# EAGLE design Shield (EAGLE 9.6.0)
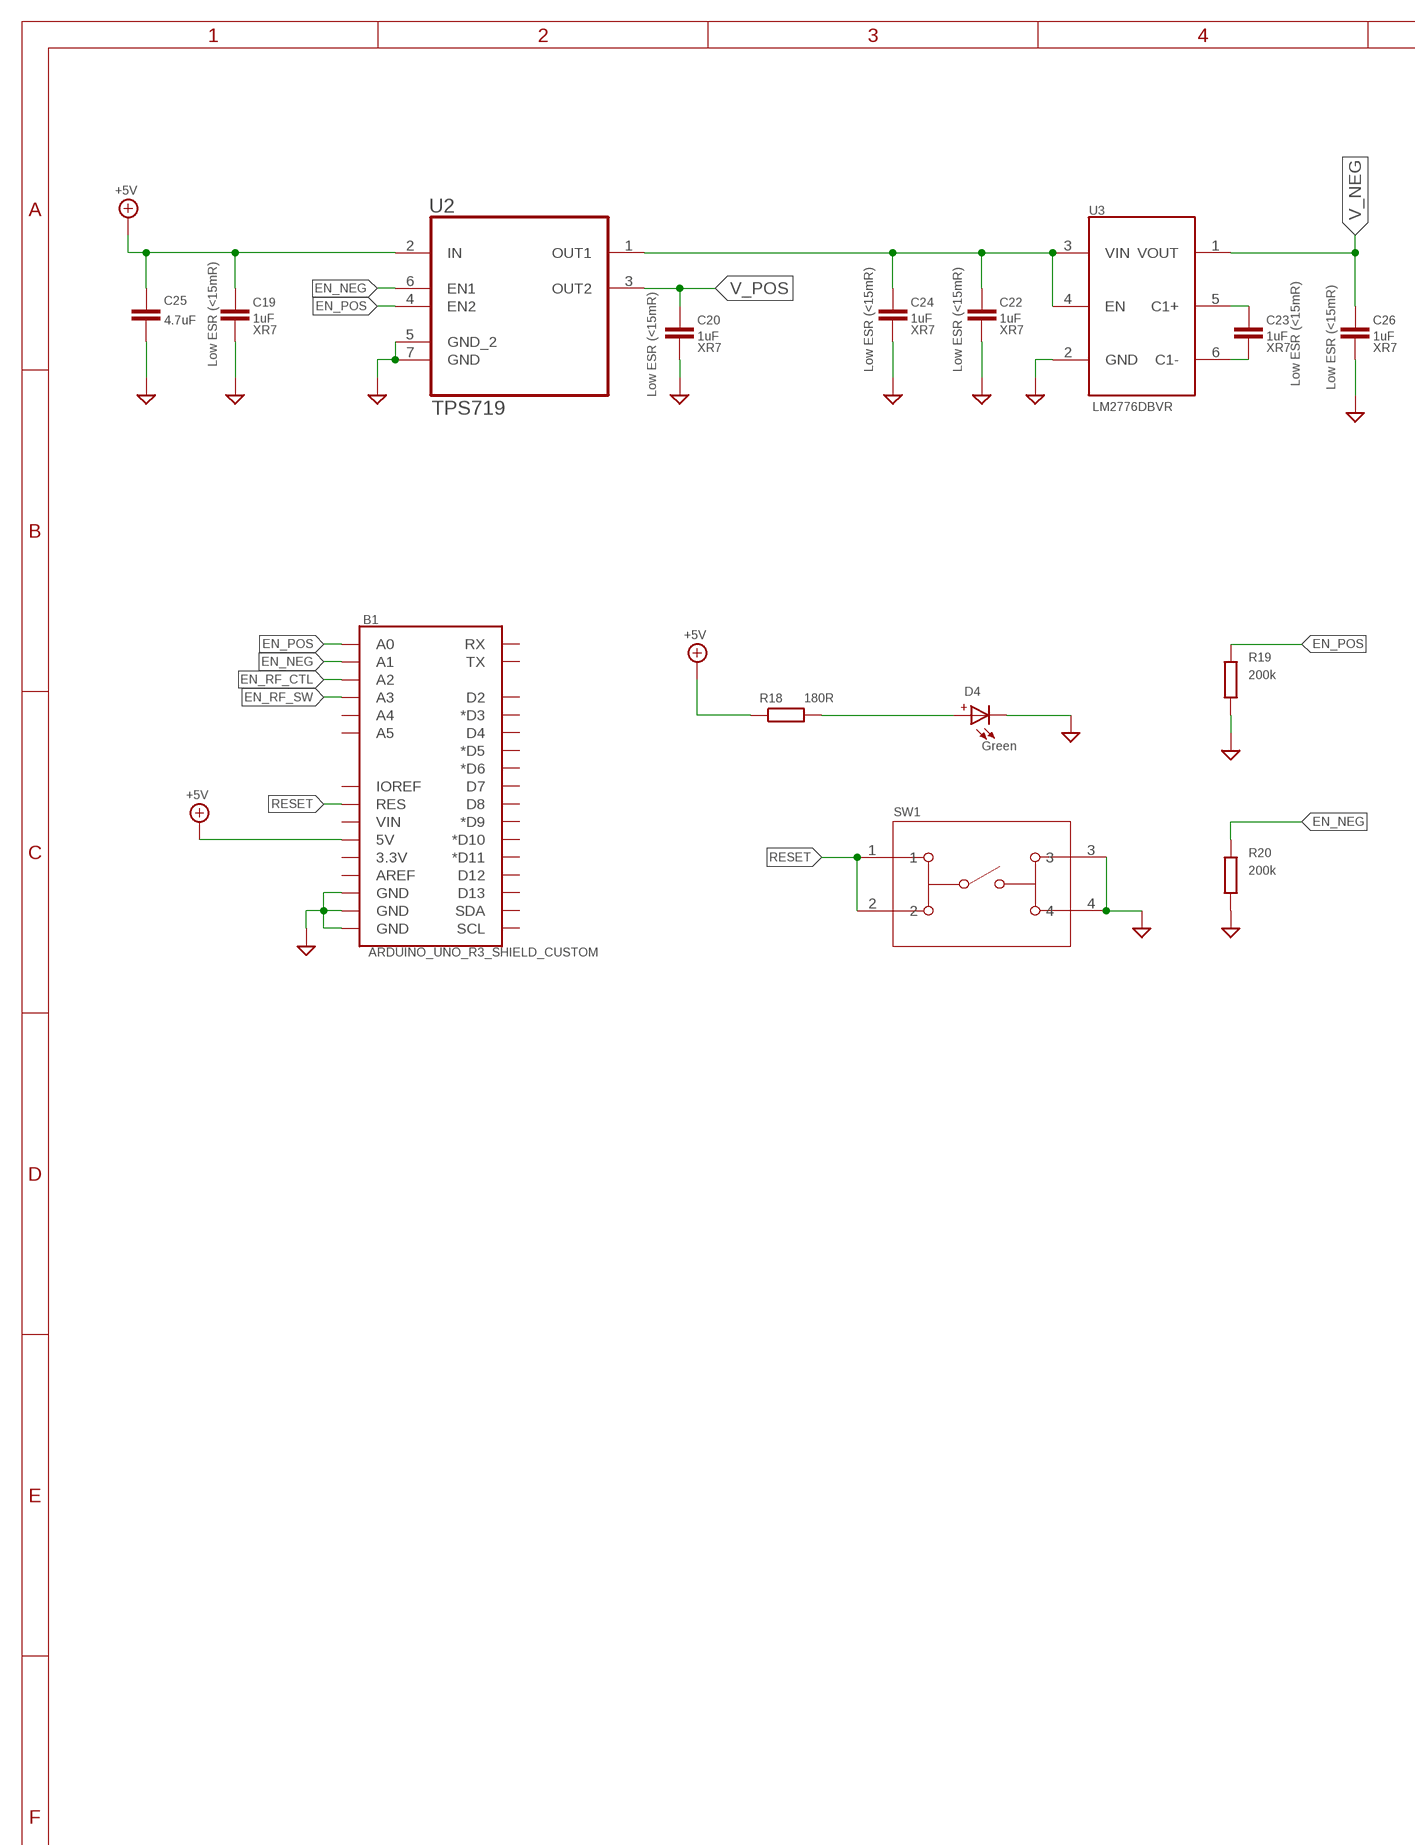
[diagram p0: schematic, sheet 1, part 1 of 2]
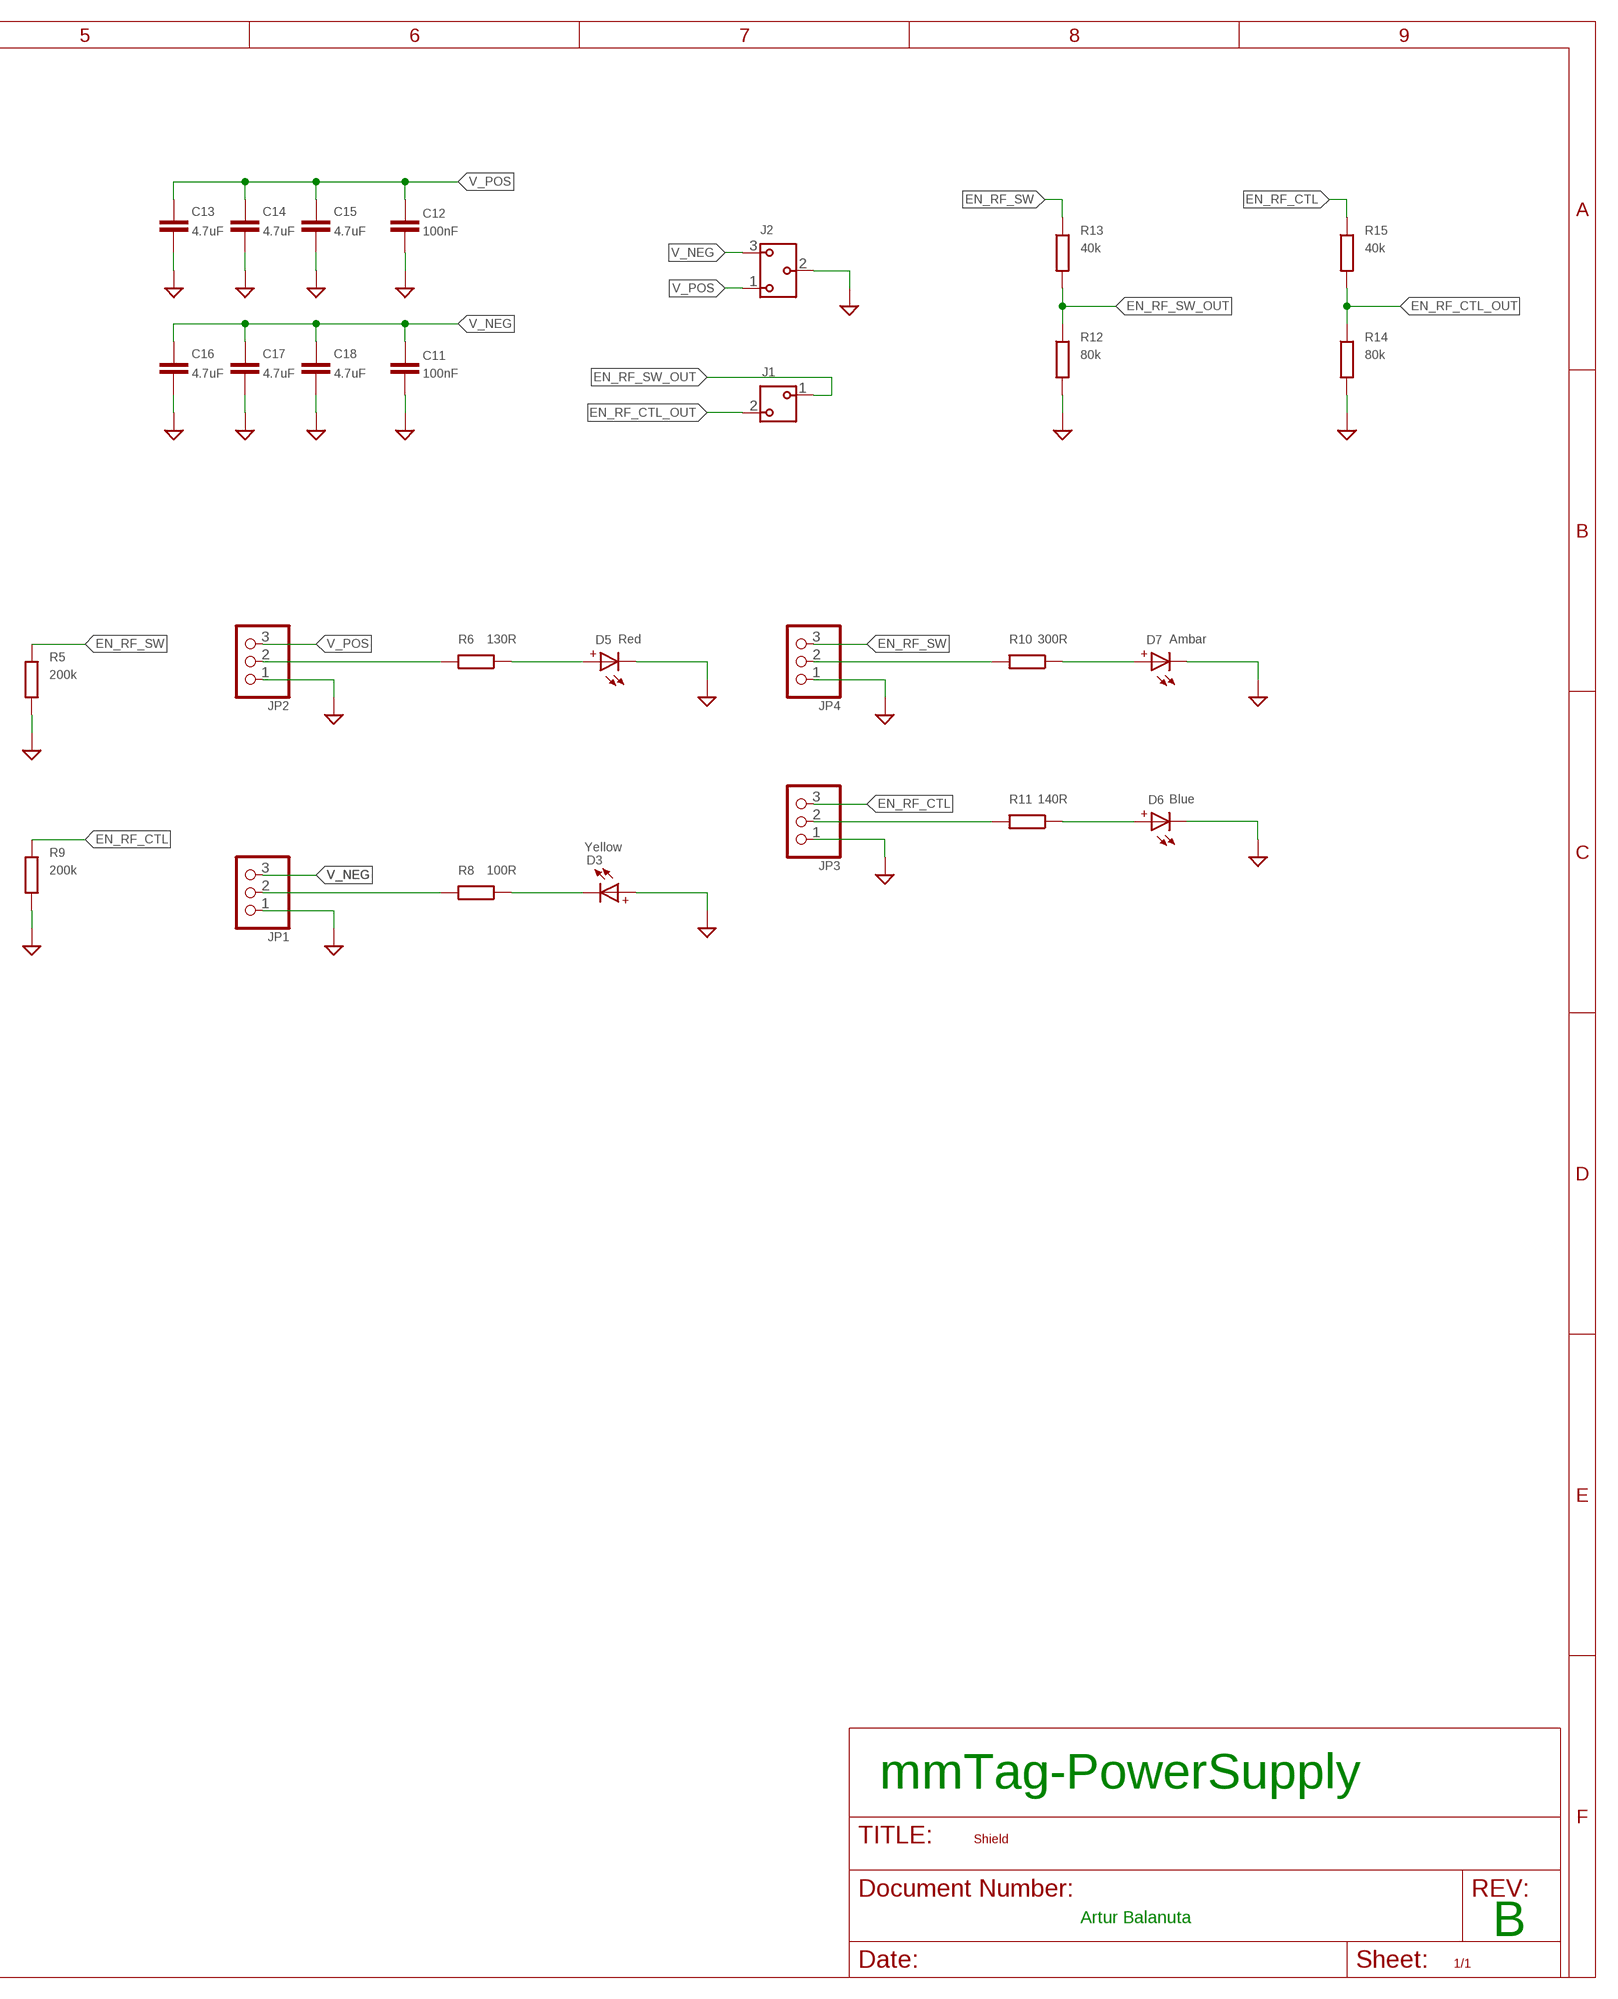
[diagram p1: schematic, sheet 1, part 2 of 2]

## Parts
B1  ARDUINO_UNO_R3_SHIELD_CUSTOM  [UNO_R3_SHIELD_NO_PROG]
C11  100nF  C-EUC0603  [C0603]
C12  100nF  C-EUC0603  [C0603]
C13  4.7uF  C-EUC1206  [C1206]
C14  4.7uF  C-EUC1206  [C1206]
C15  4.7uF  C-EUC1206  [C1206]
C16  4.7uF  C-EUC1206  [C1206]
C17  4.7uF  C-EUC1206  [C1206]
C18  4.7uF  C-EUC1206  [C1206]
C19  1uF  C-EUC0603  [C0603]
C20  1uF  C-EUC0603  [C0603]
C22  1uF  C-EUC0603  [C0603]
C23  1uF  C-EUC0603  [C0603]
C24  1uF  C-EUC0603  [C0603]
C25  4.7uF  C-EUC1206  [C1206]
C26  1uF  C-EUC0603  [C0603]
D3  WL-SMCW-150080YS75000  [WL-SMCW_0805]
D4  WL-SMCW-150080GS75000  [WL-SMCW_0805]
D5  WL-SMCW-150080RS75000  [WL-SMCW_0805]
D6  WL-SMCW-150080BS75000  [WL-SMCW_0805]
D7  WL-SMCW_150080AS75000  [WL-SMCW_0805]
J1  691412320002  [691412320002]
J2  691412320003  [691412320003]
JP1  PINHD-1X3  [1X03]
JP2  PINHD-1X3  [1X03]
JP3  PINHD-1X3  [1X03]
JP4  PINHD-1X3  [1X03]
R5  200k  R-EU_R0603  [R0603]
R6  130R  R-EU_R0603  [R0603]
R8  100R  R-EU_R0603  [R0603]
R9  200k  R-EU_R0603  [R0603]
R10  300R  R-EU_R0603  [R0603]
R11  140R  R-EU_R0603  [R0603]
R12  80k  R-EU_R0603  [R0603]
R13  40k  R-EU_R0603  [R0603]
R14  80k  R-EU_R0603  [R0603]
R15  40k  R-EU_R0603  [R0603]
R18  180R  R-EU_R0603  [R0603]
R19  200k  R-EU_R0603  [R0603]
R20  200k  R-EU_R0603  [R0603]
SW1  1825910-6  [SW4_1825910-B]
U2  TPS719  [SON6_5P200X200X80-7N]
U3  LM2776DBVR  [TEXAS_SOT23-6]

## Nets
+5V: B1.5V C19.1 C25.1 R18.1 U2.2(IN)
EN_NEG: B1.A1 R20.1 U2.6(EN1)
EN_POS: B1.A0 R19.1 U2.4(EN2)
EN_RF_CTL: B1.A2 JP3.3 R9.1 R15.1
EN_RF_CTL_OUT: J1.2 R14.1 R15.2
EN_RF_SW: B1.A3 JP4.3 R5.1 R13.1
EN_RF_SW_OUT: J1.1 R12.1 R13.2
GND: B1.GND@0(GND) B1.GND@1(GND) B1.GND@2(GND) C11.2 C12.2 C13.2 C14.2 C15.2 C16.2 C17.2 C18.2 C19.2 C20.2 C22.2 C24.2 C25.2 C26.2 D3.2(+) D4.1(-) D5.1(-) D6.1(-) D7.1(-) J2.2 JP1.1 JP2.1 JP3.1 JP4.1 R5.2 R9.2 R12.2 R14.2 R19.2 R20.2 SW1.3 SW1.4 U2.5(GND_2) U2.7(GND) U3.2(GND)
N$2: D4.2(+) R18.2
N$4: C22.1 C24.1 U2.1(OUT1) U3.3(VIN) U3.4(EN)
N$11: C23.1 U3.5(C1+)
N$12: C23.2 U3.6(C1-)
N$17: D5.2(+) R6.1
N$18: D3.1(-) R8.1
N$19: JP2.2 R6.2
N$20: JP1.2 R8.2
N$21: D7.2(+) R10.1
N$22: D6.2(+) R11.1
N$23: JP4.2 R10.2
N$24: JP3.2 R11.2
RESET: B1.RES SW1.1 SW1.2
V_NEG: C11.1 C16.1 C17.1 C18.1 C26.1 J2.3 JP1.3 U3.1(VOUT)
V_POS: C12.1 C13.1 C14.1 C15.1 C20.1 J2.1 JP2.3 U2.3(OUT2)
Unconnected: B1.3.3V B1.A4 B1.A5 B1.AREF B1.D2 B1.D3(*D3) B1.D4 B1.D5(*D5) B1.D6(*D6) B1.D7 B1.D8 B1.D9(*D9) B1.D10(*D10) B1.D11(*D11) B1.D12 B1.D13 B1.IOREF B1.RX B1.SCL B1.SDA B1.TX B1.VIN

## Notes on the sheet
- mmTag-PowerSupply
- Artur Balanuta
- B

## Library data of the parts
B1 = mmTag_PowerSupply:ARDUINO_UNO_R3_SHIELD_CUSTOM: Arduino R3 Shield Footprint Shield form compatible with the Arduino Uno R3. SparkFun Products: MG2639 Cellular Shield <https://www.sparkfun.com/products/13120> MIDI Shield <https://www.sparkfun.com/products/12898> R3 Stackable Headers Kit <https://www.sparkfun.com/products/11417>
C11-C18 C25 = resistor:C-EU: CAPACITOR, European symbol
C19 C20 C22-C24 C26 = resistor:C-EU: CAPACITOR, European symbol; ESR: Low ESR (<15mR); TYPE: XR7
D3 = Wurth_Elektronik_Optoelectronics_rev19b:WL-SMCW: SMD mono-color Chip LED Characteristics Low energy consumption High reliability Low current requirement Fast switching No UV/IR radiation Smallest SMD package with exceptional brightness Top view Wide viewing angle PBC high-usage Applications Backlight for mobile and portable device keypads Indoor and outdoor message boards Flat backlight for LCDs, switches and symbols Display for industrial control systems and traffic Miniaturized color effects Pedestrian mark Optical indicators General lighting Toys <http://katalog.we-online.de/media/images/v2/Family_WL-SMCW.jpg> Details see: http://katalog.we-online.de/en/led/WL-SMCW?m Updated 2015-04-10 2015 (C) Wurth Elektronik; COLOR: Yellow
D4 = Wurth_Elektronik_Optoelectronics_rev19b:WL-SMCW: SMD mono-color Chip LED Characteristics Low energy consumption High reliability Low current requirement Fast switching No UV/IR radiation Smallest SMD package with exceptional brightness Top view Wide viewing angle PBC high-usage Applications Backlight for mobile and portable device keypads Indoor and outdoor message boards Flat backlight for LCDs, switches and symbols Display for industrial control systems and traffic Miniaturized color effects Pedestrian mark Optical indicators General lighting Toys <http://katalog.we-online.de/media/images/v2/Family_WL-SMCW.jpg> Details see: http://katalog.we-online.de/en/led/WL-SMCW?m Updated 2015-04-10 2015 (C) Wurth Elektronik; COLOR: Green
D5 = Wurth_Elektronik_Optoelectronics_rev19b:WL-SMCW: SMD mono-color Chip LED Characteristics Low energy consumption High reliability Low current requirement Fast switching No UV/IR radiation Smallest SMD package with exceptional brightness Top view Wide viewing angle PBC high-usage Applications Backlight for mobile and portable device keypads Indoor and outdoor message boards Flat backlight for LCDs, switches and symbols Display for industrial control systems and traffic Miniaturized color effects Pedestrian mark Optical indicators General lighting Toys <http://katalog.we-online.de/media/images/v2/Family_WL-SMCW.jpg> Details see: http://katalog.we-online.de/en/led/WL-SMCW?m Updated 2015-04-10 2015 (C) Wurth Elektronik; COLOR: Red
D6 = Wurth_Elektronik_Optoelectronics_rev19b:WL-SMCW: SMD mono-color Chip LED Characteristics Low energy consumption High reliability Low current requirement Fast switching No UV/IR radiation Smallest SMD package with exceptional brightness Top view Wide viewing angle PBC high-usage Applications Backlight for mobile and portable device keypads Indoor and outdoor message boards Flat backlight for LCDs, switches and symbols Display for industrial control systems and traffic Miniaturized color effects Pedestrian mark Optical indicators General lighting Toys <http://katalog.we-online.de/media/images/v2/Family_WL-SMCW.jpg> Details see: http://katalog.we-online.de/en/led/WL-SMCW?m Updated 2015-04-10 2015 (C) Wurth Elektronik; COLOR: Blue
D7 = Wurth_Elektronik_Optoelectronics_rev19b:WL-SMCW: SMD mono-color Chip LED Characteristics Low energy consumption High reliability Low current requirement Fast switching No UV/IR radiation Smallest SMD package with exceptional brightness Top view Wide viewing angle PBC high-usage Applications Backlight for mobile and portable device keypads Indoor and outdoor message boards Flat backlight for LCDs, switches and symbols Display for industrial control systems and traffic Miniaturized color effects Pedestrian mark Optical indicators General lighting Toys <http://katalog.we-online.de/media/images/v2/Family_WL-SMCW.jpg> Details see: http://katalog.we-online.de/en/led/WL-SMCW?m Updated 2015-04-10 2015 (C) Wurth Elektronik; COLOR: Ambar
J1 = Wurth_Connectors_WR-TBL Spring Clamp:691412320002: WR-TBL Serie 4123 - 3.81 mm Screwless 45° Entry KIND PROPERTIES Pitch 3.81 mm MATERIAL PROPERTIES Insulator Material PA6/66 Insulator Flammability Rating UL94 V-0 Insulator Color Grey Contact Material Phosphor Bronze Contact Plating Matte Tin Wire Guard Material Phosphor Bronze GENERAL INFORMATION Operating Temperature -30 up to +120 °C Compliance Lead free / RoHS ELECTRICAL PROPERTIES IR UL 4 A IR VDE 4 A Working Voltage [UL] 300 V (AC) Working Voltage [VDE] 450 V (AC) Withstanding Voltage [UL] 1600 V (AC) Withstanding Voltage [VDE] 2500 V (AC) Contact Resistance 20 mΩ Mechanical Properties Wire Strip Length 7 (mm) Wire Properties Solid Wire Section (AWG) 16 to 30 (AWG) Solid Wire Section (Metric) 1.31 to 0.0509 (mm²) Stranded Wire Section (AWG) 16 to 30 (AWG) Stranded Wire Section (Metric) 1.31 to 0.0509 (mm²) CERTIFICATION UL Approval E150931 VDE Approval 40013441 Packaging Properties Packaging Box <https://www.we-online.com/catalog/media/o84303v209%20Family_WR-TBL4_6914123200xx.jpg> Details see: https://www.we-online.com/catalog/en/TBL_3_81_4123_SCREWLESS_45-DEGREE_ENTRY_6914123200xx/ Updated by Ella Wu 2019-12-31 2019(C) Wurth Elektronik; DATASHEET-URL: https://www.we-online.com/catalog/datasheet/691412320002.pdf; IR-UL: 4A; IR-VDE: 4A; MOUNT: THT; PART-NUMBER: 691412320002; PINS: 2; PITCH: 3.81mm; TYPE: 45°; WIRE: 16 to 30 (AWG) 1.31 to 0.05 (mm²); WORKING-VOLTAGE-UL: 300V (AC); WORKING-VOLTAGE-VDE: 450V (AC)
J2 = Wurth_Connectors_WR-TBL Spring Clamp:691412320003: WR-TBL Serie 4123 - 3.81 mm Screwless 45° Entry KIND PROPERTIES Pitch 3.81 mm MATERIAL PROPERTIES Insulator Material PA6/66 Insulator Flammability Rating UL94 V-0 Insulator Color Grey Contact Material Phosphor Bronze Contact Plating Matte Tin Wire Guard Material Phosphor Bronze GENERAL INFORMATION Operating Temperature -30 up to +120 °C Compliance Lead free / RoHS ELECTRICAL PROPERTIES IR UL 4 A IR VDE 4 A Working Voltage [UL] 300 V (AC) Working Voltage [VDE] 450 V (AC) Withstanding Voltage [UL] 1600 V (AC) Withstanding Voltage [VDE] 2500 V (AC) Contact Resistance 20 mΩ Mechanical Properties Wire Strip Length 7 (mm) Wire Properties Solid Wire Section (AWG) 16 to 30 (AWG) Solid Wire Section (Metric) 1.31 to 0.0509 (mm²) Stranded Wire Section (AWG) 16 to 30 (AWG) Stranded Wire Section (Metric) 1.31 to 0.0509 (mm²) CERTIFICATION UL Approval E150931 VDE Approval 40013441 Packaging Properties Packaging Box <https://www.we-online.com/catalog/media/o84303v209%20Family_WR-TBL4_6914123200xx.jpg> Details see: https://www.we-online.com/catalog/en/TBL_3_81_4123_SCREWLESS_45-DEGREE_ENTRY_6914123200xx/ Updated by Ella Wu 2019-12-31 2019(C) Wurth Elektronik; DATASHEET-URL: https://www.we-online.com/catalog/datasheet/691412320003.pdf; IR-UL: 4A; IR-VDE: 4A; MOUNT: THT; PART-NUMBER: 691412320003; PINS: 3; PITCH: 3.81mm; TYPE: 45°; WIRE: 16 to 30 (AWG) 1.31 to 0.05 (mm²); WORKING-VOLTAGE-UL: 300V (AC); WORKING-VOLTAGE-VDE: 450V (AC)
JP1-JP4 = pinhead:PINHD-1X3: PIN HEADER
R5 R6 R8-R15 R18-R20 = resistor:R-EU_: RESISTOR, European symbol
SW1 = Switches:1825910-6; BUILT_BY: EMA_UL_Team; CATEGORY: Tactile Switches; CONFIGURATION__POLE-THROW_: Single Pole - Single Throw; COPYRIGHT: Copyright (C) 2016 Accelerated Designs. All rights reserved; DESCRIPTION: FSM4JH=6MM TACT SWITCH, HIGH TEMP; MANUFACTURER_PART_NUMBER: 1825910-6; MAX_SWITCHING_CURRENT: -; MAX_SWITCHING_VOLTAGE_AC_: -; PART_STATUS: active; PRODUCT_TYPE: Switch; SERIES: ?Alcoswitch FSM; SWITCH_TYPE: Tactile Switches; TE_PART_NUMBER: 1825910-6; VENDOR: TE Connectivity
U2 = mmTag_PowerSupply:TPS719: Low-Dropout Linear Regulators; DESCRIPTION: Dual 200mA Output, Low Noise, High PSRR, Low Dropout, Linear Regulator 6-WSON -40 to 125; MF: Texas Instruments; PACKAGE: SON-6 Texas Instruments
U3 = mmTag_PowerSupply:LM2776: Switched Capacitor Inverter

## Net classes
0 default: width 0.203 mm, drill 0.305 mm, clearance 0.152 mm
3 usbvcc: width 0.203 mm, drill 0.305 mm, clearance 0.203 mm

## Board
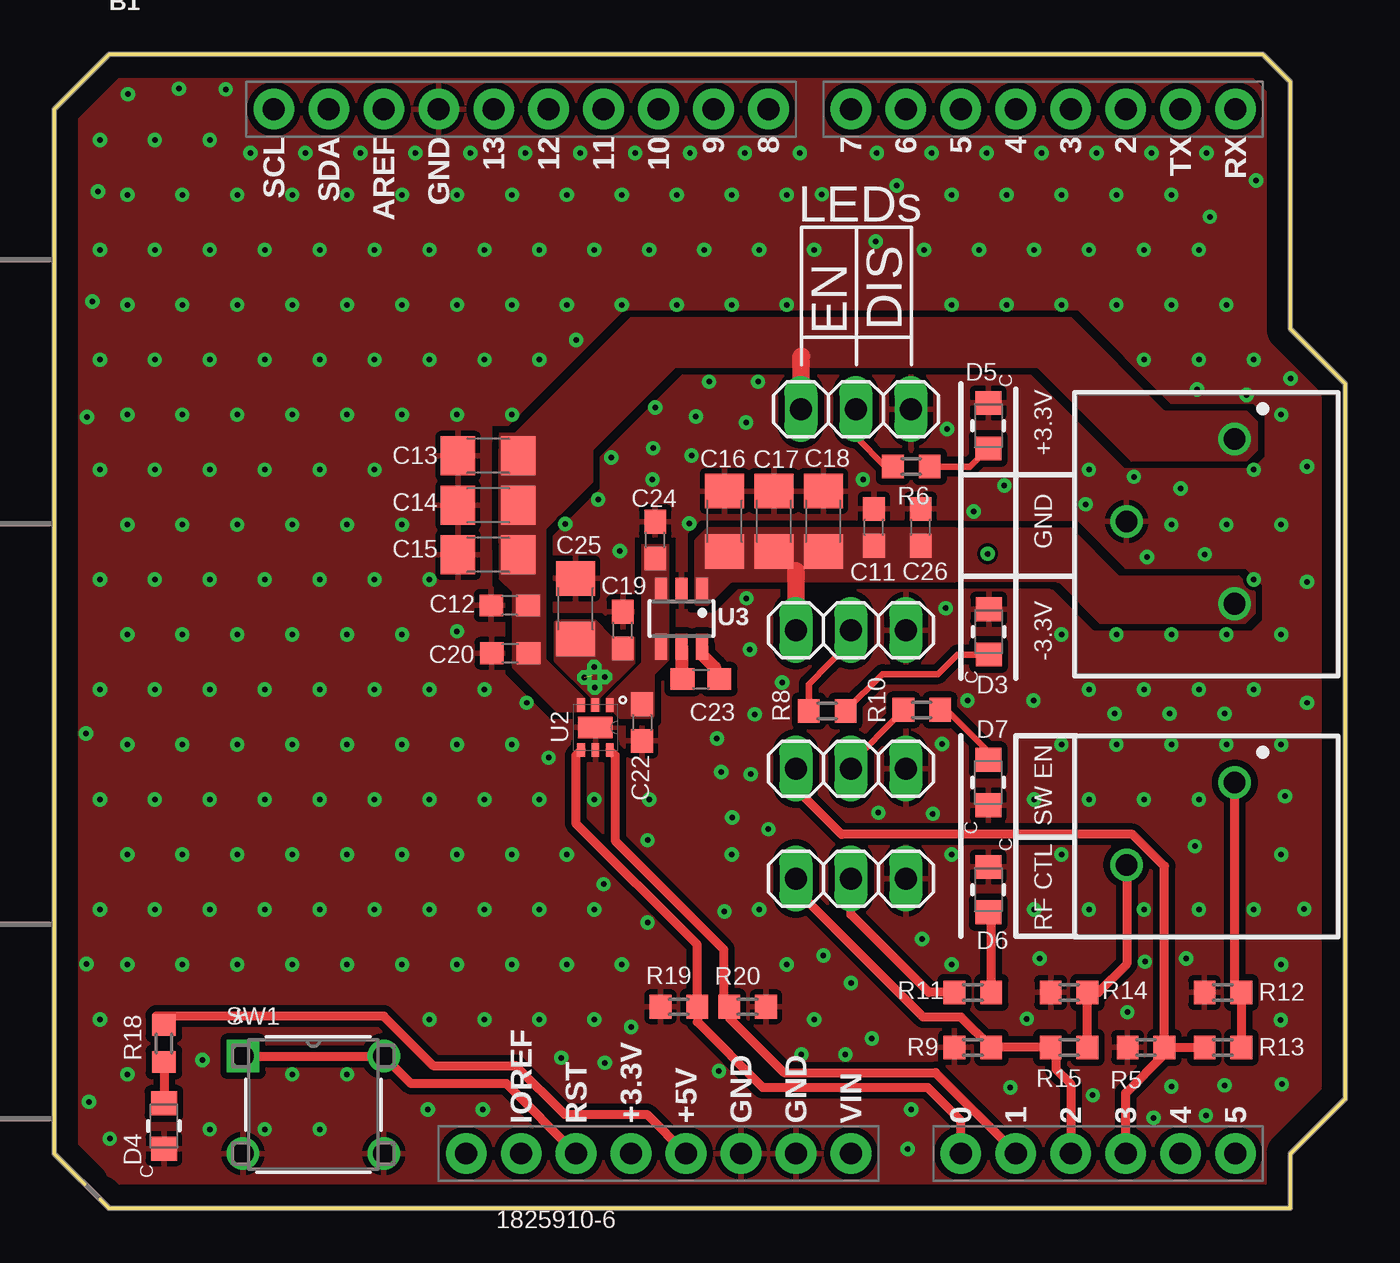
[diagram p2: board, top side]
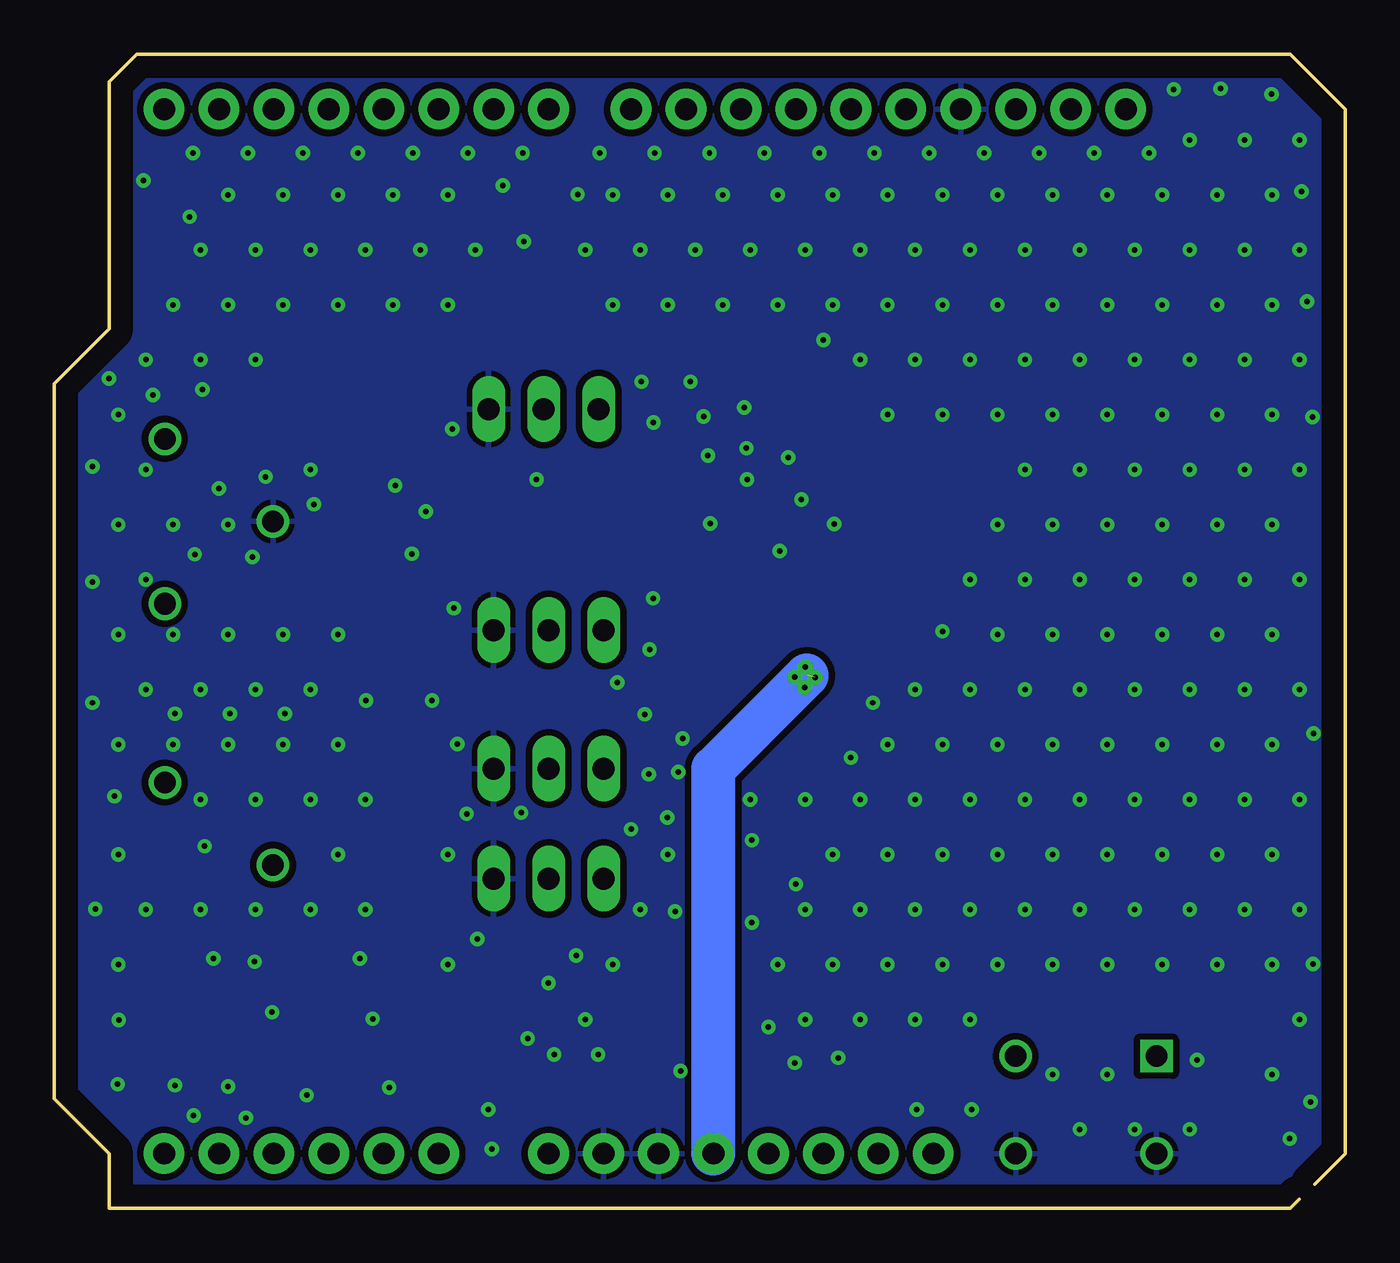
[diagram p3: board, bottom side, seen from below]

Size 59.69 x 53.34 mm. Coordinates in mm from the lower left corner, seen from the top.
Outline: 0,2.54 2.54,0 57.15,0 57.15,2.54 59.69,5.08 59.69,38.1 57.15,40.64 57.15,52.07 55.88,53.34 2.54,53.34 0,50.8 0,2.54
Copper layers (1*16): Top 0.035mm / dielectric 1.5mm / Bottom 0.035mm
Design rules "default *": minimum track width 6mil, minimum drill 0.35mm, track to track 6mil, track to pad 6mil, pad to pad 6mil, via to via 6mil, smd to smd 6mil, copper to edge 40mil, drill to drill 6mil, minimum pad ring 10mil, minimum via ring 8mil, stop-mask expansion 4mil, vias tented up to drill 10.01mm, thermal gap 10mil

### Footprints (pad centres in the part's own frame; a part is rotated, then mirrored left to right if it is on the bottom)
UNO_R3_SHIELD_NO_PROG = drill 1.016 pad 1.88: 3.3V 24.13,-2.54; 5V 24.13,0; A0 24.13,12.7; A1 24.13,15.24; A2 24.13,17.78; A3 24.13,20.32; A4 24.13,22.86; A5 24.13,25.4; AREF -24.13,-13.97; D2 -24.13,20.32; D3 -24.13,17.78; D4 -24.13,15.24; D5 -24.13,12.7; D6 -24.13,10.16; D7 -24.13,7.62; D8 -24.13,3.81; D9 -24.13,1.27; D10 -24.13,-1.27; D11 -24.13,-3.81; D12 -24.13,-6.35; D13 -24.13,-8.89; GND@0 24.13,2.54; GND@1 24.13,5.08; GND@2 -24.13,-11.43; IOREF 24.13,-7.62; NC 24.13,-10.16; RES 24.13,-5.08; RX -24.13,25.4; SCL -24.13,-19.05; SDA -24.13,-16.51; TX -24.13,22.86; VIN 24.13,7.62
C0603 = smd 1.1 x 1: 1 -0.85,0; 2 0.85,0
C1206 = smd 1.6 x 1.8: 1 -1.4,0; 2 1.4,0
WL-SMCW_0805 = smd 1.1 x 1.2: 1 -1.05,0; 2 1.05,0
691412320002 = drill 1: 1 1.905,-2.5; 2 -1.905,2.5
691412320003 = drill 1: 1 3.81,-2.5; 2 0,2.5; 3 -3.81,-2.5
1X03 = drill 1.016 long: 1 -2.54,0; 2 0,0; 3 2.54,0
R0603 = smd 1 x 1.1: 1 -0.85,0; 2 0.85,0
SW4_1825910-B = drill 0.991 pad 1.499 square: 1 -6.502,4.496 | drill 0.991 pad 1.499: 2 0,4.496; 3 -6.502,0; 4 0,0
SON6_5P200X200X80-7N = smd 0.61 x 0.356: 1 -1.041,0.66; 2 -1.041,0; 3 -1.041,-0.66; 4 1.041,-0.66; 5 1.041,0; 6 1.041,0.66 | smd 0.991 x 1.6: 7 0,0
TEXAS_SOT23-6 = smd 0.55 x 1.2: 1 -0.95,-1.3; 2 0,-1.3; 3 0.95,-1.3; 4 0.95,1.3; 5 0,1.3; 6 -0.95,1.3

### Placement (x,y rotation side)
B1  29.21,26.67 270 top
C11  37.9,31.47 90 top
C12  21.06,27.86 180 top
C13  20.07,34.77 180 top
C14  20.07,32.49 180 top
C15  20.07,30.2 180 top
C16  30.99,31.75 90 top
C17  33.27,31.75 90 top
C18  35.56,31.75 90 top
C19  26.29,26.72 90 top
C20  21.08,25.65 180 top
C22  27.18,22.45 270 top
C23  29.9,24.46 0 top
C24  27.79,30.89 90 top
C25  24.1,27.71 90 top
C26  40.06,31.47 90 top
D3  43.21,26.64 90 top
D4  5.08,3.81 90 top
D5  43.18,36.17 270 top
D6  43.18,14.73 270 top
D7  43.18,19.68 90 top
J1  52.07,17.78 90 top
J2  52.07,31.75 90 top
JP1  36.83,26.72 180 top
JP2  37.06,36.93 180 top
JP3  36.83,15.24 180 top
JP4  36.83,20.32 180 top
R5  50.47,7.44 180 top
R6  39.62,34.28 180 top
R8  35.74,22.99 180 top
R9  42.47,7.44 180 top
R10  40.11,23.04 180 top
R11  42.47,9.98 180 top
R12  54.03,9.98 180 top
R13  54.03,7.44 0 top
R14  46.91,9.98 180 top
R15  46.91,7.44 0 top
R18  5.08,7.62 270 top
R19  28.88,9.32 180 top
R20  32.05,9.32 0 top
SW1  15.24,2.54 0 top
U2  25.02,22.23 270 top
U3  29.01,27.25 180 top

### Tracks (layer width: path | path; a pad name or v marks a point on that pad's centre or on a via)
+5V  (via drill 0.25)  (1 unrouted)
  Top 0.406: B1.5V 27.41,4.34 23.6,4.34 21.34,6.6 17.53,6.6 15.24,8.89 4.74,8.89 R18.1
  Bottom 2.032: 24.89,24.64 29.21,20.32 B1.5V
  other vias: 24.99,24.08 25.45,24.56 24.97,25.02 24.51,24.54
  pour Top (no thermals): 24.82,22.96 24.82,23.6 23.14,25.27 23.14,27.1 23.24,27.2 24.99,27.2 25.76,26.44 26.77,26.44 26.82,26.39 26.82,25.17 25.22,23.57 25.22,22.96
EN_NEG
  Top 0.254: 31.2,9.14 R20.1
  Top 0.406: R20.1 30.95,9.58 30.95,11.97 25.93,16.99 25.93,20.93 U2.6 | B1.A1 44.45,2.57 40.74,6.27 33.74,6.27 31.2,8.81 31.2,9.14
EN_POS
  Top 0.406: U2.4 24.11,20.93 24.11,17.8 29.73,12.18 R19.1 29.73,8.62 32.77,5.59 40.39,5.59 41.91,4.06 B1.A0
EN_RF_CTL
  Top 0.406: JP3.3 34.29,14.73 40.15,8.87 40.16,8.84 41.92,8.84 R9.1 R15.1 46.32,7.19 46.32,6.43 46.99,5.75 B1.A2
EN_RF_CTL_OUT
  Top 0.406: J1.2 49.58,15.86 49.58,11.29 48.27,9.98 R14.1 R15.2
EN_RF_SW
  Top 0.406: B1.A3 49.53,5.33 51.32,7.12 R5.1 | R5.1 R13.1 | JP4.3 34.29,19.41 36.41,17.29 49.85,17.29 51.32,15.82 R5.1
EN_RF_SW_OUT
  Top 0.406: R13.2 R12.1 54.62,9.98 54.57,10.03 J1.1
GND  (via drill 0.25)
  other vias: 1.61,4.93 3.38,6.2 2.11,8.74 3.38,11.28 2.11,13.82 3.38,16.36 2.11,18.9 3.38,21.44 2.11,23.98 3.38,26.52 2.11,29.06 3.38,31.6 2.11,34.14 3.38,36.68 2.11,39.22 3.38,41.76 2.11,44.3 3.38,46.84 2.11,49.38 3.41,51.49 2.57,3.23 5.92,11.28 4.65,13.82 5.92,16.36 4.65,18.9 5.92,21.44 4.65,23.98 5.92,26.52 4.65,29.06 5.92,31.6 4.65,34.14 5.92,36.68 4.65,39.22 5.92,41.76 4.65,44.3 5.92,46.84 4.65,49.38 5.77,51.74 7.19,3.66 8.46,11.28 7.19,13.82 8.46,16.36 7.19,18.9 8.46,21.44 7.19,23.98 8.46,26.52 7.19,29.06 8.46,31.6 7.19,34.14 8.46,36.68 7.19,39.22 8.46,41.76 7.19,44.3 8.46,46.84 7.19,49.38 7.93,51.71 9.73,3.66 11,6.2 11,11.28 9.73,13.82 11,16.36 9.73,18.9 11,21.44 9.73,23.98 11,26.52 9.73,29.06 11,31.6 9.73,34.14 11,36.68 9.73,39.22 11,41.76 9.73,44.3 11,46.84 9.07,48.77 12.27,3.66 13.54,6.2 13.54,11.28 12.27,13.82 13.54,16.36 12.27,18.9 13.54,21.44 12.27,23.98 13.54,26.52 12.27,29.06 13.54,31.6 12.27,34.14 13.54,36.68 12.27,39.22 13.54,41.76 12.27,44.3 13.54,46.84 11.61,48.77 16.08,11.28 14.81,13.82 16.08,16.36 14.81,18.9 16.08,21.44 14.81,23.98 16.08,26.52 14.81,29.06 16.08,31.6 14.81,34.14 16.08,36.68 14.81,39.22 16.08,41.76 14.81,44.3 16.08,46.84 14.15,48.77 17.35,8.74 18.62,11.28 17.35,13.82 18.62,16.36 17.35,18.9 18.62,21.44 17.35,23.98 18.62,26.67 17.35,29.06 18.62,36.68 17.35,39.22 18.62,41.76 17.35,44.3 18.62,46.84 16.69,48.77 19.89,8.74 21.16,11.28 19.89,13.82 21.16,16.36 19.89,18.9 21.16,21.44 19.89,23.98 21.16,36.68 19.89,39.22 21.16,41.76 19.89,44.3 21.16,46.84 19.23,48.77 23.45,6.96 22.43,8.74 23.7,11.28 22.43,13.82 23.7,16.36 22.43,18.9 22.43,39.22 23.7,41.76 22.43,44.3 23.7,46.84 21.77,48.77 25.46,6.73 24.97,8.74 26.24,11.28 24.97,13.82 24.97,18.9 23.63,31.62 26.14,30.38 26.24,41.76 24.97,44.3 26.24,46.84 24.31,48.77 27.51,18.9 25.76,34.7 27.79,37.01 28.78,41.76 27.51,44.3 28.78,46.84 26.85,48.77 30.73,6.35 31.32,16.36 30.64,21.72 32.16,25.83 31.99,36.32 31.32,41.76 30.05,44.3 31.32,46.84 29.39,48.77 33.86,11.28 32.59,13.82 31.35,18.06 32.39,22.83 33.86,41.76 32.59,44.3 33.86,46.84 31.93,48.77 35.13,8.74 36.84,10.41 35.13,44.3 35.49,46.86 34.47,48.77 37.8,7.85 37.98,44.68 38.94,47.27 38.03,48.77 39.45,2.74 41.48,11.28 41.48,16.36 40.62,18.24 41.05,21.46 41.21,27.74 41.28,36.02 41.48,41.76 40.21,44.3 41.48,46.84 40.57,48.77 44.2,5.59 42.22,23.47 44.02,41.76 42.75,44.3 44.02,46.84 43.11,48.77 44.96,8.76 45.55,11.56 45.29,13.82 46.56,16.36 45.29,18.9 46.56,21.44 45.27,23.47 46.56,26.52 43.92,33.4 42.5,32.21 46.56,41.76 45.29,44.3 46.56,46.84 45.65,48.77 48.01,5.23 47.83,13.82 47.83,18.9 49.1,21.44 47.83,23.98 49.1,26.52 47.83,34.14 49.1,41.76 47.83,44.3 49.1,46.84 48.19,48.77 51.64,5.64 49.61,9.07 50.37,13.82 50.37,18.9 51.64,21.44 50.37,23.98 51.64,26.52 51.64,31.6 50.37,39.22 51.64,41.76 50.37,44.3 51.64,46.84 50.73,48.77 54.11,5.69 52.33,11.56 52.91,13.82 52.91,18.9 54.18,21.44 52.91,23.98 54.18,26.52 54.18,31.6 52.91,39.22 54.18,41.76 52.91,44.3 53.27,48.77 56.75,5.74 56.7,8.71 56.72,11.28 55.45,13.82 56.72,16.36 56.72,21.44 55.45,23.98 56.72,26.52 55.45,29.06 56.72,31.6 55.45,34.14 56.72,36.68 55.45,39.22 53.42,45.82 55.56,47.5 30.99,13.72 27.43,17.02 32.21,20.07 27.43,13.21 33.02,17.53 38.1,18.29 40.13,12.45 35.56,11.68 39.62,4.57 56.9,19.05 57.91,28.96 57.91,34.29 52.07,33.27 27.69,35.13 29.46,34.8 29.67,36.6 57.15,38.35 52.83,37.85 55.12,37.59 24.13,40.13 30.28,38.2 25.15,32.77 21.84,23.37 22.86,20.83 25.4,14.99 26.67,8.38 34.54,7.11 36.58,7.11 17.27,4.57 19.81,4.57 6.86,6.86 1.78,41.91 1.52,36.58 2.03,46.99 57.91,23.37 54.1,22.86 51.56,22.86 49.02,22.86 37.39,33.68 32,28.19 50.42,11.4 53.24,4.29 50.83,4.19 27.66,33.68 29.36,31.65 33.66,24.31 43.15,30.25 32.54,38.2 30.84,20.17 1.5,11.3 1.47,21.95 50.52,30.1 49.91,33.81 47.68,32.54 53.19,30.23 52.73,16.74 57.78,13.84
  pour Bottom (isolate 0.305, rank 2): 0,50.8 arc1 0,2.54 2.54,0 57.15,0 57.15,2.54 59.69,5.08 59.69,38.1 57.15,40.64 57.15,52.07 55.88,53.34 2.54,53.34
  pour Top (isolate 0.305, rank 2): 0,50.8 0,2.54 2.54,0 57.15,0 57.15,2.54 59.69,5.08 59.69,38.1 57.15,40.64 57.15,52.07 55.88,53.34 2.54,53.34
N$2
  Top 0.406: R18.2 D4.2
N$4
  pour Top (no thermals): 25.5,22.94 25.86,22.94 26.14,22.66 27.66,22.66 27.76,22.76 27.76,24.69 28.42,25.35 28.42,30.66 27.15,30.66 27.15,25.22 25.5,23.57
N$11
  Top 0.61: U3.5 29.01,24.7 C23.1
N$12
  Top 0.61: U3.6 29.96,25.58 30.54,25 30.54,24.47 C23.2
N$17
  Top 0.305: R6.1 42.34,34.28 D5.2
N$18
  Top 0.305: R8.1 38.3,24.7 40.86,24.7 41.76,25.59 D3.1
N$19
  Top 0.305: JP2.2 37.06,35.66 38.44,34.28 R6.2
N$20
  Top 0.305: JP1.2 36.83,26.16 35.83,25.16 35.83,25.17 34.89,24.23 R8.2
N$21
  Top 0.305: R10.1 41.24,23.04 43.18,21.09 D7.2
N$22
  Top 0.406: R11.1 43.32,13.54 D6.2
N$23
  Top 0.305: R10.2 39.13,22.91 39.13,22.87 36.83,20.57 JP4.2
N$24
  Top 0.406: R11.2 40.44,9.98 36.83,13.59 JP3.2
RESET
  Top 0.406: SW1.1 SW1.2 16.51,5.77 20.9,5.77 B1.RES
V_NEG
  Top 0.813: JP1.3 34.29,29.46
  pour Top (no thermals): 46.46,31.45 46.99,31.45 49.2,29.24 54.76,29.24 55.5,28.5 55.5,27.48 55.04,27.03 48.36,27.03 46.48,28.91 46.38,28.91 46.38,31.37
  pour Top (no thermals): 46.48,28.96 41.1,28.96 41.1,31.45 46.61,31.45 46.61,29.08
  pour Top (no thermals): 41.66,28.96 41.66,31.45 41.07,31.45 30.18,31.45 29.72,30.99 29.59,30.86 29.59,27.94 29.67,27.86 30.23,27.86 31.32,28.96
V_POS
  Top 0.813: JP2.3 34.52,39.34 34.54,39.37
  pour Top (no thermals): 24.54,23.55 22.73,25.35 22.73,35.81 20.57,35.81 20.57,29.11 21.16,28.52 21.16,25.02 23.22,22.96 24.54,22.96
  pour Top (no thermals): 49.78,34.54 55.12,34.54 55.63,35.05 55.63,36.32 55.12,36.83 51.31,36.83 46.99,41.15 26.67,41.15 20.57,35.05 24.89,35.05 28.7,38.86 45.47,38.86
  pour Top (no thermals): 24.89,35.05 24.89,33.58 22.05,30.73 20.57,30.73 20.57,35.05 21.34,35.81 25.65,35.81

### Text on the board
tPlace: LEDs | DIS | EN | +3.3V | GND | -3.3V | SW EN | RF CTL
tStop: ArtB'20 | mmTag PowerSupply | Rev B